# Altium schematic sheet CW340_PSU_VCCAUX.SchDoc: VCC-AUX/VCC-IO SMPS
size Letter; Organization: NewAE Technology Inc.; Address1: 1083 Queen St., Suite 196; Address2: Halifax; Address3: NS; Address4: Canada B3H 0B2; DocumentNumber: .; Revision: .; SheetNumber: 21; SheetTotal: 31; SheetApproved: YES
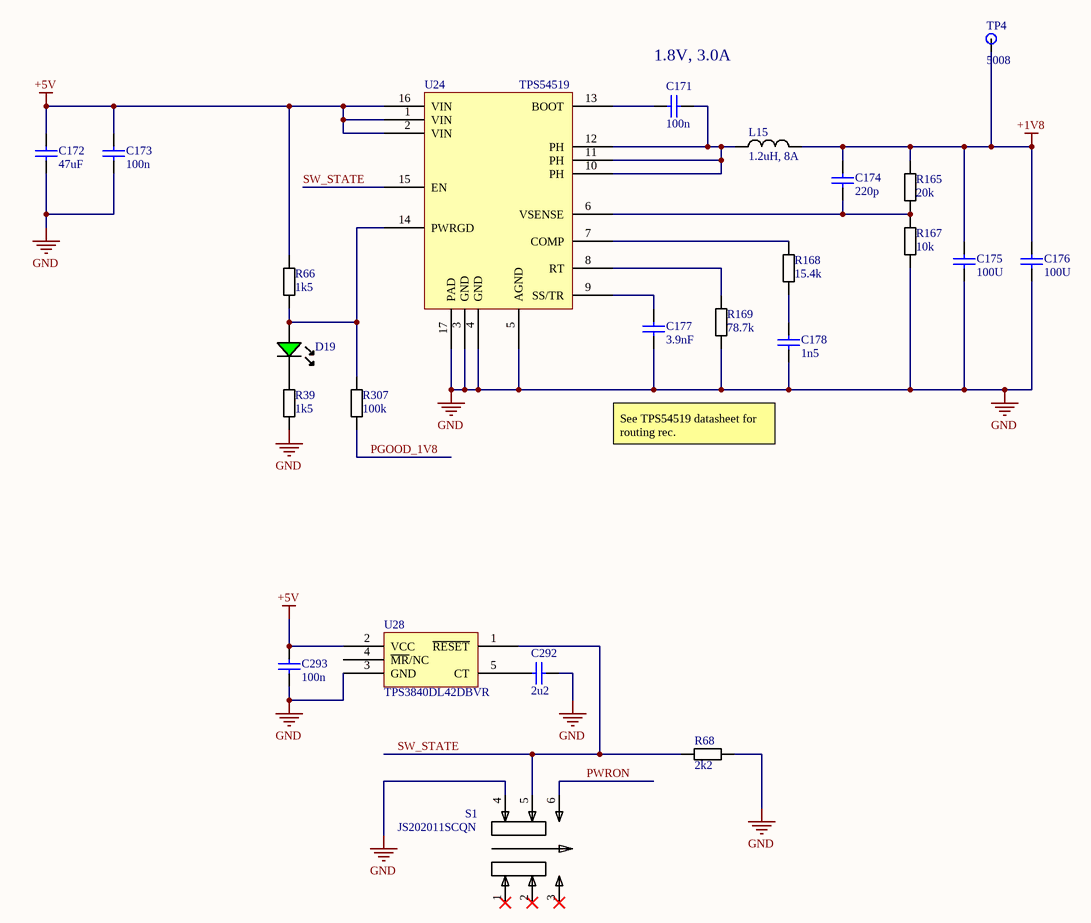
[diagram p0: CW340_PSU_VCCAUX.SchDoc]

## Parts
C171  100n  [CAPC0603_M]
C172  47uF  [CAPC3225X20N]
C173  100n  [CAPC0603_M]
C174  220p  [RESC1608X55N]
C175  100U  [CAPC1206_M]
C176  100U  [CAPC1206_M]
C177  3.9nF  [CAPC0603_M]
C178  1n5  [RESC1608X55N]
C292  2u2  [CAPC0603_M]
C293  100n  [CAPC0603_M]
D19  LED, 0603, Green  [LED-0603-GREEN]  (value not drawn)
L15  1.2uH, 8A  [XAL5030-122]
R39  1k5  [RESC1608X55N]
R66  1k5  [RESC1608X55N]
R68  2k2  [RESC1608X55N]
R165  20k  [RESC1608X55N]
R167  10k  [RESC1608X55N]
R168  15.4k  [RESC1608X55N]
R169  78.7k  [RESC1608X55N]
R307  100k  [RESC1608X55N]
S1  JS202011SCQN  [SW_JS202011SCQN]
TP4  5008  [KEYSTONE5008]
U24  TPS54519  [QFN50P300X300X80_HS-17N]
U28  TPS3840DL42DBVR  [SOT23-5P95_285X145L45X40]

## Nets
+1V8: C174.1 C175.1 C176.1 L15.2 R165.1 TP4.1
+5V: C172.1 C173.2 C293.2 R66.2 U24.1(VIN) U24.2(VIN) U24.16(VIN) U28.2(VCC)
GND: C172.2 C173.1 C175.2 C176.2 C177.2 C178.2 C292.2 C293.1 R39.2 R68.2 R167.2 R169.2 S1.4 U24.3(GND) U24.4(GND) U24.5(AGND) U24.17(PAD) U28.3(GND)
PGOOD_1V8: R307.2
PWRON: S1.6
SW_STATE: R68.1 S1.5 U24.15(EN) U28.1(~{RESET})
NetC171_1: C171.1 U24.13(BOOT)
NetC171_2: C171.2 L15.1 U24.10(PH) U24.11(PH) U24.12(PH)
NetC174_2: C174.2 R165.2 R167.1 U24.6(VSENSE)
NetC177_1: C177.1 U24.9(SS/TR)
NetC178_1: C178.1 R168.2
NetC292_1: C292.1 U28.5(CT)
NetD19_A: D19.A R66.1 R307.1 U24.14(PWRGD)
NetD19_K: D19.K R39.1
NetR168_1: R168.1 U24.7(COMP)
NetR169_1: R169.1 U24.8(RT)

Not connected (* = marked no-connect by the designer): S1 1* 2* 3*; U28 4(~{MR}/NC)

## Notes on the sheet
- (near C171) 1.8V, 3.0A
- See TPS54519 datasheet for routing rec.
- Title:
- Date:
- Rev:
- Time:
- Project:
- Sheet
- of
- License:
- Copyright © NewAE Technology Inc.
- Approved:
- NewAE.com
- File:

## Library data of the parts
C171 C173 C293 = CCHIP-100n-0603: 100n, 0603; Manufacture 1: Kemet; Manufacture Part Number 1: C0603C104K5RACTU; Component Group: Capacitor; Case-EIA: 0603; Case-Metric: 1608; Rated Voltage: 50VDC; Part Number: CCHIP-100n-0603; Footprint: 0603; Pin Count: 2; Supplier 1: Digi-Key; Supplier Part Number 1: 399-5089-2-ND; Value: 100n; Mounting Technology: SMT; Component Kind: Standard; Component Type: Standard
  C171 C173: LCSC Equivalent: C1591
C172 = CCHIP-47u-1210: 47u, 10V, 1210, Ceramic; Manufacture 1: TDK Corporation; Manufacture Part Number 1: C3225X5R1A476M250AC; Component Group: Capacitor; Case-EIA: 1210; Case-Metric: 3225; Rated Voltage: 10VDC; Tolerance: 20%; Part Number: CCHIP-47u-1210; Footprint: 1210; Pin Count: 2; Supplier 1: Digi-Key; Supplier Part Number 1: 445-6711-1-ND; Value: 47uF; Mounting Technology: SMT; Temperature Range: -55C to 85C; Component Kind: Standard; Component Type: Standard
C174 = CCHIP-220P-0603-250V: CAP CER 220PF 250V X7R 0603; Manufacture 1: Murata Electronics North America; Manufacture Part Number 1: GRM188R72E221KW07D; Component Group: Capacitor; Case-EIA: 0603; Case-Metric: 1608; Tolerance: ±10%; PP Material Stack: 0; Part Number: CCHIP-220P-0603-250V; Footprint: 0603; Pin Count: 2; Supplier 1: Digi-Key; Supplier Part Number 1: 490-3521-1-ND; Value: 220p; Rated Voltage: 250V; Mounting Technology: SMT; Component Kind: Standard; Component Type: Standard; PP Rotation: 0
C175 C176 = CCHIP-100u-1206-6.3v: CAP CER 100UF 6.3V X5R 1206; Manufacture 1: Murata Electronics; Manufacture Part Number 1: GRM31CR60J107ME39L; Component Group: Capacitor; Case-EIA: 1206; Case-Metric: 3216; Rated Voltage: 6.3VDC; Part Number: CCHIP-100u-1206-6.3v; Footprint: 1206; Pin Count: 2; Supplier 1: Digi-Key; Supplier Part Number 1: 490-4539-2-ND; Value: 100U; Mounting Technology: SMT; Component Kind: Standard; Component Type: Standard
C177 = CCHIP-3n9-0603: 3n9, 0603; Manufacture 1: Murata; Manufacture Part Number 1: GCM1885C1H392FA16J; Component Group: Capacitor; Case-EIA: 0603; Case-Metric: 1608; PP Material Stack: 0; Tolerance: 1%; Part Number: CCHIP-3n9-0603; Footprint: 0603; Pin Count: 2; Value: 3.9nF; Mounting Technology: SMT; Component Kind: Standard; Component Type: Standard; PP Rotation: 0; Supplier 1: Digi-Key; Supplier Part Number 1: 490-GCM1885C1H392FA16JCT-ND
C178 = CCHIP-1N5-0603-100V: CAP CER 1500PF 100V X7R 0603; Manufacture 1: Murata Electronics North America; Manufacture Part Number 1: GRM188R72A152KA01D; Component Group: Capacitor; Case-EIA: 0603; Case-Metric: 1608; Tolerance: ±10%; PP Material Stack: 0; Part Number: CCHIP-1N5-0603-100V; Footprint: 0603; Pin Count: 2; Supplier 1: Digi-Key; Supplier Part Number 1: 490-1475-1-ND; Value: 1n5; Rated Voltage: 100V; Mounting Technology: SMT; Component Kind: Standard; Component Type: Standard; PP Rotation: 0
C292 = CCHIP-2u2-0603: 2u2, 0603; Manufacture 1: Samsung; Manufacture Part Number 1: CL10B225KP8NNNC; Component Group: Capacitor; Case-EIA: 0603; Case-Metric: 1608; Rated Voltage: 10VDC; Part Number: CCHIP-2u2-0603; Footprint: 0603; Pin Count: 2; Supplier 1: Digi-Key; Value: 2u2; Mounting Technology: SMT; Component Kind: Standard; Component Type: Standard; Supplier Part Number 1: 1276-1134-1-ND
D19 = LEDCHIP_0603_GREEN: Chip LED, Green; Manufacture 1: Kingbright; Manufacture Part Number 1: APT1608CGCK; Component Group: Optical; PP Material Stack: 16; PP Rotation: -90; Part Number: LEDCHIP_0603_GREEN; Pin Count: 2; Supplier 1: Digi-Key; Supplier Part Number 1: 754-1116-1-ND; Mounting Technology: SMT; Component Kind: Standard; Component Type: Standard
L15 = XAL5030-122: 1.2uH, 8A RMS, 12A SAT; Manufacture 1: Coilcraft; Manufacture Part Number 1: XAL5030-122MEB; Component Group: Inductor; PP Material Stack: 0; Part Number: XAL5030-122; Footprint: XAL5030; Pin Count: 2; Supplier 1: Mouser; Value: 1.2uH, 8A; Mounting Technology: SMT; Component Kind: Standard; Component Type: Standard; PP Rotation: 0
R39 R66 = RCHIP-1K5-0603: 1k5 res, 0603, 1%, 1/10W; Manufacture 1: Yageo; Manufacture Part Number 1: RC0603FR-071K5L; Component Group: Resistor; Case-EIA: 0603; Case-Metric: 1608; Rated Power: 0.1W; Rated Voltage: 75VDC; Part Number: RCHIP-1K5-0603; Footprint: 0603; Pin Count: 2; Supplier 1: Digi-Key; Supplier Part Number 1: 311-1.50KHRCT-ND; Value: 1k5; Tolerance: 1%; Mounting Technology: SMT; Temperature Range: -55C to 155C; Component Kind: Standard; Component Type: Standard
R68 = RCHIP-2K2-0603: 2k2 res, 0603, 1%, 1/10W; Manufacture 1: Yageo; Manufacture Part Number 1: RC0603FR-072K2L; Component Group: Resistor; Case-EIA: 0603; Case-Metric: 1608; Rated Power: 0.1W; Rated Voltage: 75VDC; Part Number: RCHIP-2K2-0603; Footprint: 0603; Pin Count: 2; Supplier 1: Digi-Key; Supplier Part Number 1: 311-2.20KHRCT-ND; Value: 2k2; Tolerance: 1%; Mounting Technology: SMT; Temperature Range: -55C to 155C; Component Kind: Standard; Component Type: Standard
R165 = RCHIP-20K-0603: 20k res, 0603, 1%, 1/10W; Manufacture 1: Yageo; Manufacture Part Number 1: RC0603FR-0720KL; Component Group: Resistor; Case-EIA: 0603; Case-Metric: 1608; Rated Power: 0.1W; Rated Voltage: 75VDC; Part Number: RCHIP-20K-0603; Footprint: 0603; Pin Count: 2; Supplier 1: Digi-Key; Supplier Part Number 1: 311-20.0KHRCT-ND; Value: 20k; Tolerance: 1%; Mounting Technology: SMT; Temperature Range: -55C to 155C; Component Kind: Standard; Component Type: Standard
R167 = RCHIP-10K-0603: 10k res, 0603, 1%, 1/10W; Manufacture 1: Yageo; Manufacture Part Number 1: RC0603FR-0710KL; Component Group: Resistor; Case-EIA: 0603; Case-Metric: 1608; Rated Power: 0.1W; Rated Voltage: 75VDC; Part Number: RCHIP-10K-0603; Footprint: 0603; Pin Count: 2; Supplier 1: Digi-Key; Supplier Part Number 1: 311-10.0KHRCT-ND; Value: 10k; Tolerance: 1%; Mounting Technology: SMT; Temperature Range: -55C to 155C; Component Kind: Standard; Component Type: Standard
R168 = RCHIP-15k4-0603: 15k4 res, 0603, 1%, 1/10W; Manufacture 1: Yageo; Manufacture Part Number 1: RC0603FR-0715K4L; Component Group: Resistor; Case-EIA: 0603; Case-Metric: 1608; Rated Power: 0.1W; Rated Voltage: 75VDC; Part Number: RCHIP-15k4-0603; Footprint: 0603; Pin Count: 2; Supplier 1: Digi-Key; Value: 15.4k; Tolerance: 1%; Mounting Technology: SMT; Temperature Range: -55C to 155C; Component Kind: Standard; Component Type: Standard; Supplier Part Number 1: 311-15.4KHRCT-ND
R169 = RCHIP-78k7-0603: 78k7 res, 0603, 1%, 1/10W; Manufacture 1: Yageo; Manufacture Part Number 1: RC0603FR-078K7L; Component Group: Resistor; Case-EIA: 0603; Case-Metric: 1608; Rated Power: 0.1W; Rated Voltage: 75VDC; Part Number: RCHIP-78k7-0603; Footprint: 0603; Pin Count: 2; Supplier 1: Digi-Key; Value: 78.7k; Tolerance: 1%; Mounting Technology: SMT; Temperature Range: -55C to 155C; Component Kind: Standard; Component Type: Standard; Supplier Part Number 1: 311-78.7KHRCT-ND
R307 = RCHIP-100K-0603: 100k res, 0603, 1%, 1/10W; Manufacture 1: Yageo; Manufacture Part Number 1: RC0603FR-07100KL; Component Group: Resistor; Case-EIA: 0603; Case-Metric: 1608; Rated Power: 0.1W; Rated Voltage: 75VDC; Part Number: RCHIP-100K-0603; Footprint: 0603; Pin Count: 2; Supplier 1: Digi-Key; Supplier Part Number 1: 311-100KHRCT-ND; Value: 100k; Tolerance: 1%; Mounting Technology: SMT; Temperature Range: -55C to 155C; Component Kind: Standard; Component Type: Standard
S1 = JS202011SCQN: DPDT SMD Switch, 300mA; Manufacture 1: C&K Components; Part Number: JS202011SCQN; Component Group: Switch; Manufacture Part Number 1: JS202011SCQN; Pin Count: 6; Supplier 1: Digi-Key; Supplier Part Number 1: 401-2002-1-ND; Value: DPDT; Mounting Technology: SMT; Component Kind: Standard; Component Type: Standard
TP4 = KEYSTONE_5008: TEST POINT PC COMPACT .063"D ORG; Part Number: KEYSTONE_5008; Component Group: Test Point; Pin Count: 1; Supplier 1: Digi-Key; Supplier Part Number 1: 36-5008-ND; Mounting Technology: Through-hole; Component Kind: Standard; Component Type: Standard
U24 = TPS54519: 6V Input, 5A, SMPS; Manufacture 1: Texas Instruments; Component Group: Analog IC; PP Material Stack: 0; Part Number: TPS54519; Footprint: 16-QFN; Manufacture Part Number 1: TPS54519; Pin Count: 17; Component Kind: Standard; Component Type: Standard; PP Rotation: 0; Mounting Technology: SMT
U28 = TPS3840DL42DBVR: Reset Supervisor; Manufacture 1: Texas Instruments; Component Group: Analog IC; PP Material Stack: 0; Part Number: TPS3840DL42DBVR; Footprint: SOT25; Manufacture Part Number 1: TPS3840DL42DBVR; Pin Count: 5; Supplier 1: Digi-Key; Supplier Part Number 1: TPS3840DL42DBVRCT-ND; Mounting Technology: SMT; RoHS: Yes; Component Kind: Standard; Component Type: Standard; PP Rotation: 0